# EAGLE design esp8266-blynk (EAGLE 7.5.0)
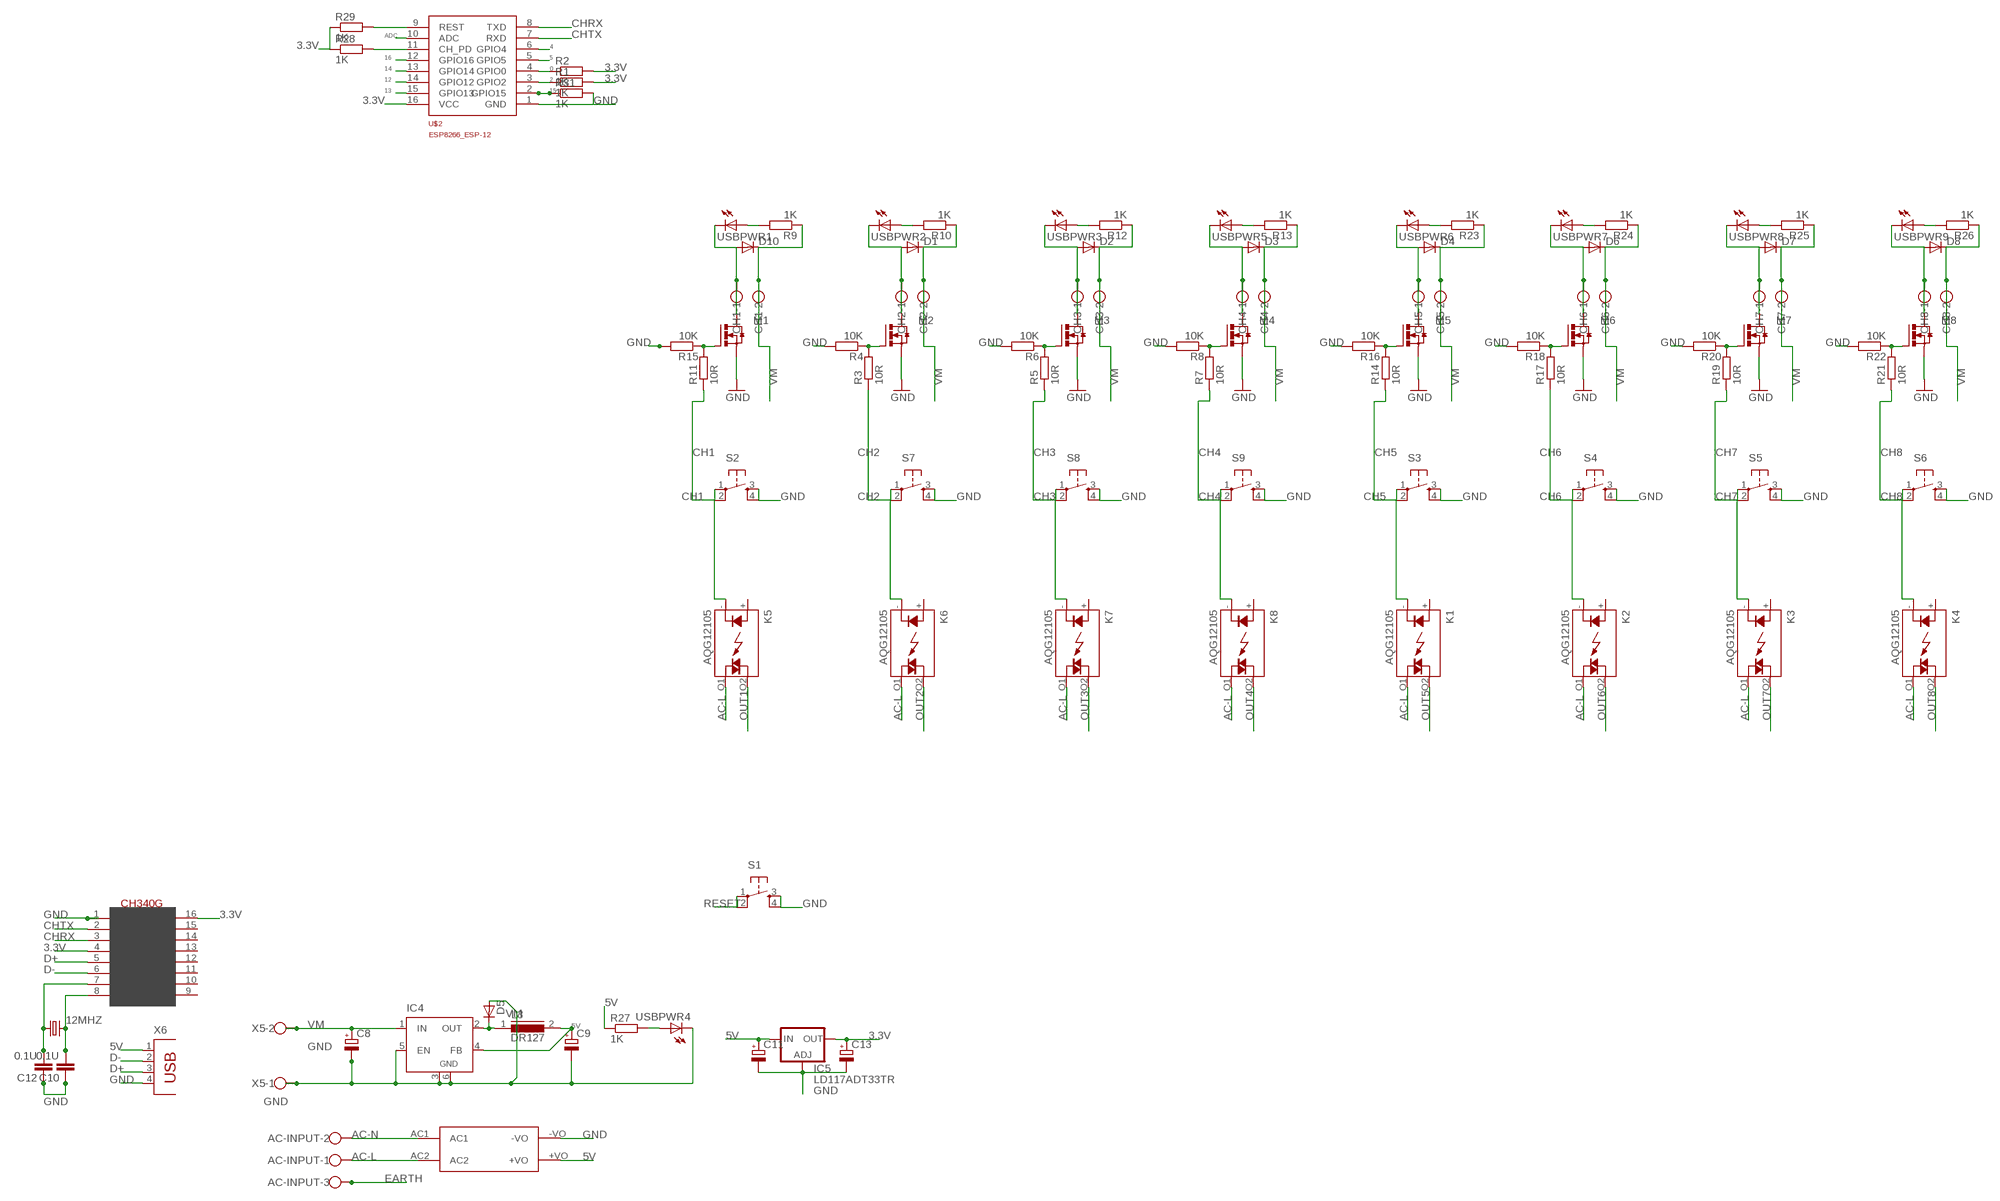
[diagram p0: schematic, sheet 1]

## Parts
12MHZ  CRYSTALHC49UP  [HC49UP]
AC-INPUT  W237-103  [W237-103]
C8  CPOL-EUE  [PANASONIC_E]
C9  CPOL-EUE  [PANASONIC_E]
C10  0.1U  C-EUC1206  [C1206]
C11  CPOL-EUC  [PANASONIC_C]
C12  0.1U  C-EUC1206  [C1206]
C13  CPOL-EUC  [PANASONIC_C]
CH1  W237-102  [W237-102]
CH2  W237-102  [W237-102]
CH3  W237-102  [W237-102]
CH4  W237-102  [W237-102]
CH5  W237-102  [W237-102]
CH6  W237-102  [W237-102]
CH7  W237-102  [W237-102]
CH8  W237-102  [W237-102]
D1  DIODESMA-ALT  [SMA-DIODE_ALT]
D2  DIODESMA-ALT  [SMA-DIODE_ALT]
D3  DIODESMA-ALT  [SMA-DIODE_ALT]
D4  DIODESMA-ALT  [SMA-DIODE_ALT]
D5  D-SOD-87  [SOD87]
D6  DIODESMA-ALT  [SMA-DIODE_ALT]
D7  DIODESMA-ALT  [SMA-DIODE_ALT]
D8  DIODESMA-ALT  [SMA-DIODE_ALT]
D10  DIODESMA-ALT  [SMA-DIODE_ALT]
IC4  LM2596S  [TO263-5]
IC5  LD117ADT33TR  [DPACK]
K1  AQG12105  [AQG]
K2  AQG12105  [AQG]
K3  AQG12105  [AQG]
K4  AQG12105  [AQG]
K5  AQG12105  [AQG]
K6  AQG12105  [AQG]
K7  AQG12105  [AQG]
K8  AQG12105  [AQG]
L3  DR127  [DR127]
M1  IRLR024N  [TO252]
M2  IRLR024N  [TO252]
M3  IRLR024N  [TO252]
M4  IRLR024N  [TO252]
M5  IRLR024N  [TO252]
M6  IRLR024N  [TO252]
M7  IRLR024N  [TO252]
M8  IRLR024N  [TO252]
R1  1K  R-EU_M1206  [M1206]
R2  1K  R-EU_M1206  [M1206]
R3  10R  R-EU_M1206  [M1206]
R4  10K  R-EU_M1206  [M1206]
R5  10R  R-EU_M1206  [M1206]
R6  10K  R-EU_M1206  [M1206]
R7  10R  R-EU_M1206  [M1206]
R8  10K  R-EU_M1206  [M1206]
R9  1K  R-EU_M1206  [M1206]
R10  1K  R-EU_M1206  [M1206]
R11  10R  R-EU_M1206  [M1206]
R12  1K  R-EU_M1206  [M1206]
R13  1K  R-EU_M1206  [M1206]
R14  10R  R-EU_M1206  [M1206]
R15  10K  R-EU_M1206  [M1206]
R16  10K  R-EU_M1206  [M1206]
R17  10R  R-EU_M1206  [M1206]
R18  10K  R-EU_M1206  [M1206]
R19  10R  R-EU_M1206  [M1206]
R20  10K  R-EU_M1206  [M1206]
R21  10R  R-EU_M1206  [M1206]
R22  10K  R-EU_M1206  [M1206]
R23  1K  R-EU_M1206  [M1206]
R24  1K  R-EU_M1206  [M1206]
R25  1K  R-EU_M1206  [M1206]
R26  1K  R-EU_M1206  [M1206]
R27  1K  R-EU_M1206  [M1206]
R28  1K  R-EU_M1206  [M1206]
R29  1K  R-EU_M1206  [M1206]
R31  1K  R-EU_M1206  [M1206]
S1  TAC_SWITCHPTH  [TACTILE-PTH]
S2  TAC_SWITCHPTH  [TACTILE-PTH]
S3  TAC_SWITCHPTH  [TACTILE-PTH]
S4  TAC_SWITCHPTH  [TACTILE-PTH]
S5  TAC_SWITCHPTH  [TACTILE-PTH]
S6  TAC_SWITCHPTH  [TACTILE-PTH]
S7  TAC_SWITCHPTH  [TACTILE-PTH]
S8  TAC_SWITCHPTH  [TACTILE-PTH]
S9  TAC_SWITCHPTH  [TACTILE-PTH]
U$1  HLK-PM01  [HLK-PM01]
U$2  ESP8266_ESP-12  [ESP8266-ESP12]
U$4  CH340G  [SOIC16]
USBPWR1  LED3MM  [LED3MM]
USBPWR2  LED3MM  [LED3MM]
USBPWR3  LED3MM  [LED3MM]
USBPWR4  LED3MM  [LED3MM]
USBPWR5  LED3MM  [LED3MM]
USBPWR6  LED3MM  [LED3MM]
USBPWR7  LED3MM  [LED3MM]
USBPWR8  LED3MM  [LED3MM]
USBPWR9  LED3MM  [LED3MM]
X5  W237-102  [W237-102]
X6  PN61729  [PN61729]

## Nets
0: R2.1 U$2.4(GPIO0)
2: R1.1 U$2.3(GPIO2)
3.3V: C13.+ IC5.4(OUT) R1.2 R2.2 R28.1 R29.1 U$2.16(VCC) U$4.4(V3) U$4.16(VCC)
4: U$2.6(GPIO4)
5: U$2.5(GPIO5)
5V: C9.+ C11.+ IC4.4(FB) IC5.3(IN) L3.2 R27.1 U$1.+VO X6.1
12: U$2.14(GPIO12)
13: U$2.15(GPIO13)
14: U$2.13(GPIO14)
15: R31.1 U$2.2(GPIO15)
16: U$2.12(GPIO16)
AC-L: AC-INPUT.1 K1.O1(DS2) K2.O1(DS2) K3.O1(DS2) K4.O1(DS2) K5.O1(DS2) K6.O1(DS2) K7.O1(DS2) K8.O1(DS2) U$1.AC2
AC-N: AC-INPUT.2 U$1.AC1
ADC: U$2.10(ADC)
CH1: K5.-(K) R11.1 S2.1 S2.2
CH2: K6.-(K) R3.1 S7.1 S7.2
CH3: K7.-(K) R5.1 S8.1 S8.2
CH4: K8.-(K) R7.1 S9.1 S9.2
CH5: K1.-(K) R14.1 S3.1 S3.2
CH6: K2.-(K) R17.1 S4.1 S4.2
CH7: K3.-(K) R19.1 S5.1 S5.2
CH8: K4.-(K) R21.1 S6.1 S6.2
CHRX: U$2.8(TXD) U$4.3(RX)
CHTX: U$2.7(RXD) U$4.2(TX)
D+: U$4.5(D+) X6.3
D-: U$4.6(D-) X6.2
EARTH: AC-INPUT.3
GND: C8.- C9.- C10.1 C11.- C12.1 C13.- D5.2(A) IC4.3(GND) IC4.5(EN) IC4.6(GND) IC5.1(ADJ) M1.2(S) M2.2(S) M3.2(S) M4.2(S) M5.2(S) M6.2(S) M7.2(S) M8.2(S) R4.2 R6.2 R8.2 R15.2 R16.2 R18.2 R20.2 R22.2 R31.2 S1.3 S1.4 S2.3 S2.4 S3.3 S3.4 S4.3 S4.4 S5.3 S5.4 S6.3 S6.4 S7.3 S7.4 S8.3 S8.4 S9.3 S9.4 U$1.-VO U$2.1(GND) U$4.1(GND) USBPWR4.K(C) X5.1 X6.4
N$1: M2.1(G) R3.2 R4.1
N$2: M3.1(G) R5.2 R6.1
N$3: M4.1(G) R7.2 R8.1
N$4: R9.2 USBPWR1.A
N$6: R10.2 USBPWR2.A
N$7: R12.2 USBPWR3.A
N$8: R13.2 USBPWR5.A
N$9: D5.1(C) IC4.2(OUT) L3.1
N$10: R27.2 USBPWR4.A
N$12: 12MHZ.1 C12.2 U$4.7(XI)
N$13: 12MHZ.2 C10.2 U$4.8(XO)
N$15: M5.1(G) R14.2 R16.1
N$18: R28.2 U$2.11(CH_PD)
N$20: M6.1(G) R17.2 R18.1
N$24: M7.1(G) R19.2 R20.1
N$28: M8.1(G) R21.2 R22.1
N$29: R23.2 USBPWR6.A
N$30: R24.2 USBPWR7.A
N$31: R25.2 USBPWR8.A
N$32: R26.2 USBPWR9.A
N$67: M1.1(G) R11.2 R15.1
OUT1: CH1.1 D10.A K5.O2(DS1) M1.3(D) USBPWR1.K(C)
OUT2: CH2.1 D1.A K6.O2(DS1) M2.3(D) USBPWR2.K(C)
OUT3: CH3.1 D2.A K7.O2(DS1) M3.3(D) USBPWR3.K(C)
OUT4: CH4.1 D3.A K8.O2(DS1) M4.3(D) USBPWR5.K(C)
OUT5: CH5.1 D4.A K1.O2(DS1) M5.3(D) USBPWR6.K(C)
OUT6: CH6.1 D6.A K2.O2(DS1) M6.3(D) USBPWR7.K(C)
OUT7: CH7.1 D7.A K3.O2(DS1) M7.3(D) USBPWR8.K(C)
OUT8: CH8.1 D8.A K4.O2(DS1) M8.3(D) USBPWR9.K(C)
RESET: R29.2 S1.1 S1.2 U$2.9(REST)
VM: C8.+ CH1.2 CH2.2 CH3.2 CH4.2 CH5.2 CH6.2 CH7.2 CH8.2 D1.C D2.C D3.C D4.C D6.C D7.C D8.C D10.C IC4.1(IN) R9.1 R10.1 R12.1 R13.1 R23.1 R24.1 R25.1 R26.1 X5.2
Unconnected: K1.+(A) K2.+(A) K3.+(A) K4.+(A) K5.+(A) K6.+(A) K7.+(A) K8.+(A) U$4.9(CTS) U$4.10(DSR) U$4.11(RI) U$4.12(DCD) U$4.13(DTR) U$4.14(RTS) U$4.15(RS232)

## Library data of the parts
12MHZ = crystal:CRYSTAL: CRYSTAL; OC_FARNELL: unknown; OC_NEWARK: unknown
AC-INPUT = con-wago-500:W237-103: WAGO SCREW CLAMP; MPN: 237-103; OC_FARNELL: unknown; OC_NEWARK: 18M7116
C8 C9 = resistor:CPOL-EU: POLARIZED CAPACITOR, European symbol
C10 C12 = rcl:C-EU: CAPACITOR, European symbol
C11 C13 = rcl:CPOL-EU: POLARIZED CAPACITOR, European symbol
CH1-CH8 X5 = con-wago-500:W237-102: WAGO SCREW CLAMP; MPN: 237-102; OC_FARNELL: unknown; OC_NEWARK: 70K9898
D1-D4 D6-D8 D10 = SparkFun-DiscreteSemi:DIODE: Diode These are standard reverse protection diodes and small signal diodes. SMA package can handle up to about 1A. SOD-323 can handle about 200mA. What the SOD-323 package when ordering, there are some mfgs out there that are 5-pin packages.
D5 = semicon-smd-ipc:D-: DIODE unfilled
IC4 = linear:LM2596S: STEP-DOWN VOLTAGE REGULATOR
IC5 = v-reg:LD117A?*: Low drop fixed and adjustable positive voltage regulators 1 A Source: http://www.st.com/stonline/products/literature/ds/7194/ld1117axx.pdf
K1-K8 = relay:AQG*: SOLID STATE RELAY NAiS Zero-cross, Non zero-cross Source: http://www.mew-europe.com/.. en_ds_61611_0000.pdf; MF: AROMAT/ MATSUSHITA; MPN: AQG12105; OC_FARNELL: unknown; OC_NEWARK: 20J4759
L3 = inductors:DR127: High Power Density, High Efficiency, Shielded Inductors Source: coiltronics_dr_series.pdf
M1-M8 = to252(1):IRLR024N
R1 R2 R9 R10 R12 R13 R23-R29 R31 = rcl:R-EU_: RESISTOR, European symbol
R3-R8 R11 R14-R22 = resistor:R-EU_: RESISTOR, European symbol
S1-S9 = SparkFun:TAC_SWITCH: Momentary Switch Button commonly used for reset or general input. Spark Fun Electronics SKU : COM-00097
U$1 = hlk-pm01:HLK-PM01
U$2 = ESP8266-ESP12:ESP8266_ESP-12: ESP8266 ESP-12 Discussion about pins here: http://www.esp8266.com/viewtopic.php?f=13&t=1429
U$4 = usb-serial:CH340G
USBPWR1-USBPWR9 = RepRapjr:LED: LED OSRAM: - CHIPLED LG R971, LG N971, LY N971, LG Q971, LY Q971, LO R971, LY R971 LH N974, LH R974 LS Q976, LO Q976, LY Q976 LO Q996 - Hyper CHIPLED LW Q18S LB Q993, LB Q99A, LB R99A - SideLED LS A670, LO A670, LY A670, LG A670, LP A670 LB A673, LV A673, LT A673, LW A673 LH A674 LY A675 LS A676, LA A676, LO A676, LY A676, LW A676 LS A679, LY A679, LG A679 - Hyper Micro SIDELED® LS Y876, LA Y876, LO Y876, LY Y876 LT Y87S - SmartLED LW L88C, LW L88S LB L89C, LB L89S, LG L890 LS L89K, LO L89K, LY L89K LS L896, LA L896, LO L896, LY L896 - TOPLED LS T670, LO T670, LY T670, LG T670, LP T670 LSG T670, LSP T670, LSY T670, LOP T670, LYG T670 LG T671, LOG T671, LSG T671 LB T673, LV T673, LT T673, LW T673 LH T674 LS T676, LA T676, LO T676, LY T676, LB T676, LH T676, LSB T676, LW T676 LB T67C, LV T67C, LT T67C, LS T67K, LO T67K, LY T67K, LW E67C LS E67B, LA E67B, LO E67B, LY E67B, LB E67C, LV E67C, LT E67C LW T67C LS T679, LY T679, LG T679 LS T770, LO T770, LY T770, LG T770, LP T770 LB T773, LV T773, LT T773, LW T773 LH T774 LS E675, LA E675, LY E675, LS T675 LS T776, LA T776, LO T776, LY T776, LB T776 LHGB T686 LT T68C, LB T68C - Hyper Mini TOPLED® LB M676 - Mini TOPLED Santana® LG M470 LS M47K, LO M47K, LY M47K Source: http://www.osram.convergy.de LUXEON: - LUMILED® LXK2-PW12-R00, LXK2-PW12-S00, LXK2-PW14-U00, LXK2-PW14-V00 LXK2-PM12-R00, LXK2-PM12-S00, LXK2-PM14-U00 LXK2-PE12-Q00, LXK2-PE12-R00, LXK2-PE12-S00, LXK2-PE14-T00, LXK2-PE14-U00 LXK2-PB12-K00, LXK2-PB12-L00, LXK2-PB12-M00, LXK2-PB14-N00, LXK2-PB14-P00, LXK2-PB14-Q00 LXK2-PR12-L00, LXK2-PR12-M00, LXK2-PR14-Q00, LXK2-PR14-R00 LXK2-PD12-Q00, LXK2-PD12-R00, LXK2-PD12-S00 LXK2-PH12-R00, LXK2-PH12-S00 LXK2-PL12-P00, LXK2-PL12-Q00, LXK2-PL12-R00 Source: www.luxeon.com KINGBRIGHT: KA-3528ASYC Source: www.kingbright.com
X6 = con-berg:PN61729: BERG USB connector; OC_FARNELL: unknown; OC_NEWARK: unknown

## Net classes
1 power: width 0.6 mm, clearance 0.305 mm

## Board
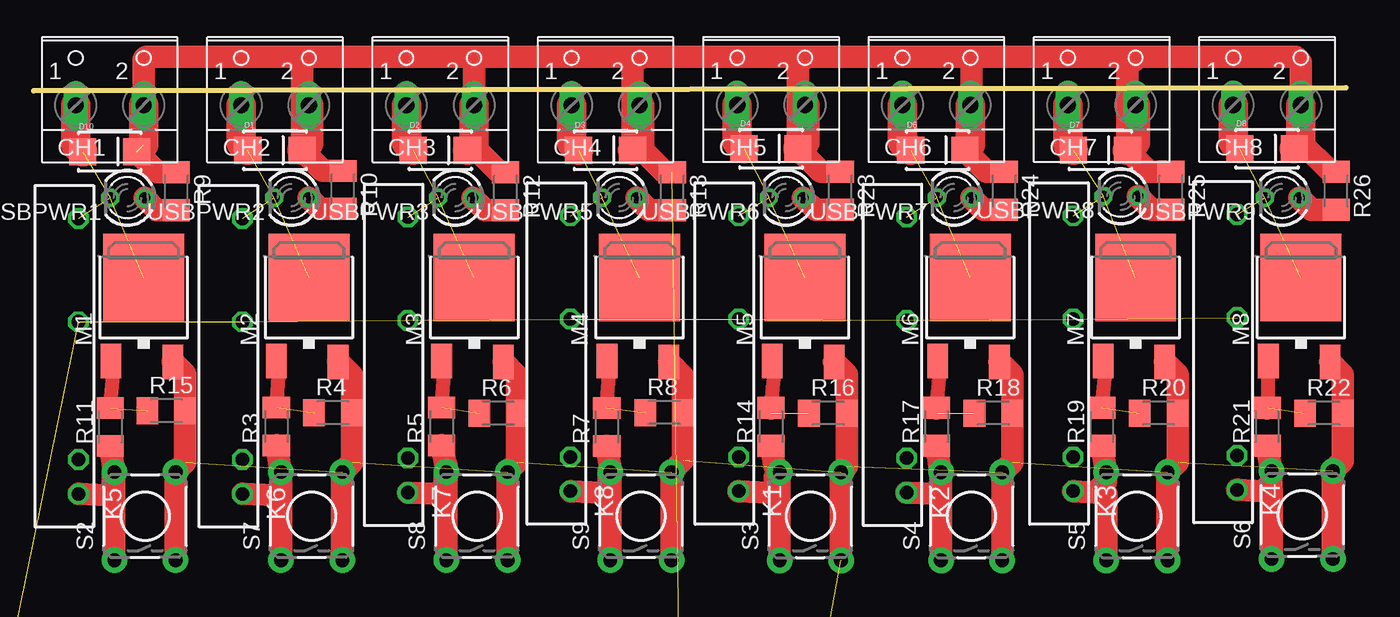
[diagram p1: board, top side]

Size 96.8 x 0.2 mm. Coordinates in mm from the lower left corner, seen from the top.
Outline: 0,0 96.8,0.2
Copper layers (1*16): Top 0.035mm / dielectric 1.5mm / Bottom 0.035mm
Design rules "dirt_cheap_dirty_boards.v1": minimum track width 5mil, minimum drill 12mil, track to track 5mil, track to pad 5mil, pad to pad 5mil, via to via 5mil, smd to smd 0mil, copper to edge 10mil, drill to drill 10mil, minimum pad ring 10mil, minimum via ring 6mil, stop-mask expansion 2mil, vias tented up to drill 25mil, thermal gap 10mil

### Footprints (pad centres in the part's own frame; a part is rotated, then mirrored left to right if it is on the bottom)
HC49UP = smd 5.334 x 1.93: 1 -4.826,0; 2 4.826,0
W237-103 = drill 1.194 long: 1 -5,-1.29; 2 0,-1.29; 3 5,-1.29
PANASONIC_E = smd 3.8 x 1.4: + 3,0; - -3,0
C1206 = smd 1.6 x 1.8: 1 -1.4,0; 2 1.4,0
PANASONIC_C = smd 2.6 x 1.4: + 2.05,0; - -2.05,0
W237-102 = drill 1.194 long: 1 -2.5,-1.27; 2 2.5,-1.27
SMA-DIODE_ALT = smd 2 x 2: A -2,0; C 2,0
SOD87 = smd 1.45 x 2.6: 1 -2.445,0; 2 2.445,0
TO263-5 = smd 1.067 x 2.159: 1 -3.404,-5.791; 2 -1.702,-5.791; 3 0,-5.791; 4 1.702,-5.791; 5 3.404,-5.791 | smd 10.8 x 10.41: 6 0,2.54
DPACK = smd 1.6 x 3: 1 -2.28,-4.8; 3 2.28,-4.8 | smd 5.8 x 6.2: 4 0,2.38
AQG = drill 1 octagon: + -7.62,0; - -10.16,0; O1 2.54,0; O2 10.16,0
DR127 = smd 3.85 x 5.5: 1 -4.975,0; 2 4.975,0
TO252 = smd 1.524 x 2.54: 1 -2.407,-3.657; 2 2.153,-3.72 | smd 5.97 x 6.48: 3 0,2.5
M1206 = smd 1.6 x 2: 1 -1.4,0; 2 1.4,0
TACTILE-PTH = drill 1.016 pad 1.88: 1 -3.251,2.261; 2 3.251,2.261; 3 -3.251,-2.261; 4 3.251,-2.261
HLK-PM01 = drill 1 long: +VO 31.7,2.4; -VO 31.7,17.8; AC1 2.3,12.6; AC2 2.3,7.6
ESP8266-ESP12 = smd 2 x 1.2: 1 16.2,2; 2 16.2,4; 3 16.2,6; 4 16.2,8; 5 16.2,10; 6 16.2,12; 7 16.2,14; 8 16.2,16; 9 0,16; 10 0,14; 11 0,12; 12 0,10; 13 0,8; 14 0,6; 15 0,4; 16 0,2
SOIC16 = smd 0.635 x 1.524: 1 -4.445,-2.695; 2 -3.175,-2.695; 3 -1.905,-2.695; 4 -0.635,-2.695; 5 0.635,-2.695; 6 1.905,-2.695; 7 3.175,-2.695; 8 4.445,-2.695; 9 4.445,2.695; 10 3.175,2.695; 11 1.905,2.695; 12 0.635,2.695; 13 -0.635,2.695; 14 -1.905,2.695; 15 -3.175,2.695; 16 -4.445,2.695
LED3MM = drill 0.813 octagon: A -1.27,0; K 1.27,0
PN61729 = drill 0.95 octagon: 1 1.25,4.71; 2 -1.25,4.71; 3 -1.25,2.71; 4 1.25,2.71 | hole 2.3: -6.02,0; 6.02,0

### Placement (x,y rotation side)
12MHZ  69.73,-59.39 0 top  (outside the outline)
AC-INPUT  -64.1,-378 0 top  (outside the outline)
C8  50.99,-64.89 180 top  (outside the outline)
C9  50.99,-48.7 180 top  (outside the outline)
C10  74.24,-54.58 180 top  (outside the outline)
C11  57.69,-42.93 90 top  (outside the outline)
C12  66.81,-54.62 180 top  (outside the outline)
C13  46.33,-44.93 90 top  (outside the outline)
CH1  5.59,0.19 0 top
CH2  17.79,0.19 0 top
CH3  29.99,0.19 0 top
CH4  42.19,0.19 0 top
CH5  54.4,0.2 0 top
CH6  66.6,0.2 0 top
CH7  78.8,0.2 0 top
CH8  91,0.2 0 top
D1  17.79,-4.41 0 top  (outside the outline)
D2  29.99,-4.41 0 top  (outside the outline)
D3  42.19,-4.41 0 top  (outside the outline)
D4  54.4,-4.3 0 top  (outside the outline)
D5  51.63,-57.27 0 top  (outside the outline)
D6  66.7,-4.4 0 top  (outside the outline)
D7  78.7,-4.4 0 top  (outside the outline)
D8  91,-4.3 0 top  (outside the outline)
D10  5.59,-4.51 0 top  (outside the outline)
IC4  36.39,-61.72 90 top  (outside the outline)
IC5  51.53,-44.22 90 top  (outside the outline)
K1  52,-19.4 90 top  (outside the outline)
K2  64.4,-19.5 90 top  (outside the outline)
K3  76.7,-19.4 90 top  (outside the outline)
K4  88.8,-19.3 90 top  (outside the outline)
K5  3.3,-19.6 90 top  (outside the outline)
K6  15.4,-19.6 90 top  (outside the outline)
K7  27.6,-19.5 90 top  (outside the outline)
K8  39.6,-19.4 90 top  (outside the outline)
L3  35.75,-47.74 180 top  (outside the outline)
M1  8.1,-16.3 0 top  (outside the outline)
M2  20.3,-16.3 0 top  (outside the outline)
M3  32.5,-16.3 0 top  (outside the outline)
M4  44.7,-16.3 0 top  (outside the outline)
M5  56.9,-16.3 0 top  (outside the outline)
M6  69.1,-16.3 0 top  (outside the outline)
M7  81.3,-16.3 0 top  (outside the outline)
M8  93.5,-16.3 0 top  (outside the outline)
R1  22.81,-66.3 0 top  (outside the outline)
R2  22.86,-69.47 0 top  (outside the outline)
R3  17.9,-24.78 90 top  (outside the outline)
R4  22.07,-23.77 0 top  (outside the outline)
R5  30.09,-24.78 90 top  (outside the outline)
R6  34.27,-23.81 0 top  (outside the outline)
R7  42.28,-24.82 90 top  (outside the outline)
R8  46.52,-23.76 0 top  (outside the outline)
R9  10.52,-7.43 270 top  (outside the outline)
R10  22.81,-7.33 270 top  (outside the outline)
R11  5.64,-24.83 90 top  (outside the outline)
R12  34.81,-7.43 270 top  (outside the outline)
R13  47.11,-7.43 270 top  (outside the outline)
R14  54.4,-24.8 90 top  (outside the outline)
R15  9.77,-23.62 0 top  (outside the outline)
R16  58.6,-23.8 0 top  (outside the outline)
R17  66.6,-24.8 90 top  (outside the outline)
R18  70.8,-23.8 0 top  (outside the outline)
R19  78.8,-24.8 90 top  (outside the outline)
R20  83,-23.8 0 top  (outside the outline)
R21  91,-24.8 90 top  (outside the outline)
R22  95.2,-23.8 0 top  (outside the outline)
R23  59.5,-7.4 270 top  (outside the outline)
R24  71.6,-7.4 270 top  (outside the outline)
R25  83.9,-7.4 270 top  (outside the outline)
R26  96.1,-7.4 270 top  (outside the outline)
R27  48.73,-72.63 270 top  (outside the outline)
R28  22.9,-76.23 180 top  (outside the outline)
R29  22.9,-72.76 180 top  (outside the outline)
R31  22.8,-62.96 180 top  (outside the outline)
S1  35.43,-72.81 180 top  (outside the outline)
S2  8.2,-31.4 90 top  (outside the outline)
S3  57.3,-31.41 90 top  (outside the outline)
S4  69.2,-31.41 90 top  (outside the outline)
S5  81.4,-31.41 90 top  (outside the outline)
S6  93.6,-31.31 90 top  (outside the outline)
S7  20.5,-31.4 90 top  (outside the outline)
S8  32.7,-31.4 90 top  (outside the outline)
S9  44.8,-31.4 90 top  (outside the outline)
U$1  -70.6,-373.1 0 top  (outside the outline)
U$2  20.04,-77.69 90 top  (outside the outline)
U$4  67.53,-68.41 90 top  (outside the outline)
USBPWR1  6.89,-7.92 180 top  (outside the outline)
USBPWR2  18.99,-7.91 180 top  (outside the outline)
USBPWR3  31.09,-7.91 180 top  (outside the outline)
USBPWR4  48.73,-78.21 270 top  (outside the outline)
USBPWR5  43.19,-7.91 180 top  (outside the outline)
USBPWR6  55.5,-7.9 180 top  (outside the outline)
USBPWR7  67.9,-7.9 180 top  (outside the outline)
USBPWR8  80.2,-7.8 180 top  (outside the outline)
USBPWR9  92.1,-7.9 180 top  (outside the outline)
X5  41.3,-74.42 0 top  (outside the outline)
X6  80.97,-69.07 90 top  (outside the outline)

### Tracks (layer width: path | path; a pad name or v marks a point on that pad's centre or on a via)
0  (1 unrouted)
2  (1 unrouted)
3.3V  (8 unrouted)
5V  (7 unrouted)
15  (1 unrouted)
AC-L  (9 unrouted)
AC-N  (1 unrouted)
CH1
  Top 1.676: R11.1 S2.2 | K5.- 5.34,-29.86 5.8,-29.4 5.8,-28.29 S2.2 | S2.1 S2.2
CH2
  Top 1.676: R3.1 18.2,-28.11 S7.2 | K6.- 17.84,-29.86 18.2,-29.5 18.2,-28.19 S7.2 | S7.1 S7.2
CH3
  Top 1.676: R5.1 30.39,-27.6 | 30.39,-27.6 30.39,-28.1 S8.2 30.3,-28.29 30.3,-29.2 29.74,-29.76 K7.- | S8.1 30.44,-27.65 30.39,-27.6
CH4
  Top 1.676: R7.1 42.58,-28.11 S9.2 | K8.- 41.94,-29.66 42.4,-29.2 42.4,-28.29 S9.2 | S9.1 S9.2
CH5
  Top 1.676: R14.1 54.7,-27.81 S3.2 | K1.- 54.24,-29.66 54.7,-29.2 54.7,-28.49 S3.2 | S3.1 S3.2
CH6
  Top 1.676: R17.1 66.9,-28.12 S4.2 | K2.- 66.44,-29.76 66.9,-29.3 66.9,-28.2 S4.2 | S4.1 S4.2
CH7
  Top 1.676: R19.1 79.1,-28.12 S5.2 79.1,-28.2 79.1,-28.9 78.7,-29.3 | K3.- 78.34,-29.66 78.7,-29.3 | S5.1 79.14,-29.74 78.7,-29.3
CH8
  Top 1.676: R21.1 91.3,-28.02 S6.2 91.3,-28.1 91.3,-29 91.1,-29.2 | K4.- 90.74,-29.56 91.1,-29.2 | S6.1 91.34,-29.44 91.1,-29.2
CHRX  (1 unrouted)
CHTX  (1 unrouted)
D+  (1 unrouted)
D-  (1 unrouted)
GND  (27 unrouted)
  Top 1.676: S2.3 S2.4 11.17,-27.44 R15.2 11.17,-20.94 M1.2 | S7.3 22.7,-34.59 22.7,-34.1 22.76,-34.04 S7.4 23.47,-27.44 R4.2 23.47,-21.04 M2.2 | S8.3 S8.4 35.67,-27.44 R6.2 35.67,-21.04 M3.2 | S9.3 S9.4 47.92,-27.29 R8.2 47.92,-21.09 M4.2 | S3.3 S3.4 60,-27.71 R16.2 60,-20.97 M5.2 | S4.3 S4.4 72.2,-27.42 R18.2 72.2,-20.97 M6.2 | S5.3 S5.4 84.4,-27.42 R20.2 84.4,-20.97 M7.2 | S6.3 S6.4 96.6,-27.32 R22.2 96.6,-20.97 M8.2
N$1  (1 unrouted)
  Top 1.016: R3.2 18.09,-20.48 M2.1
N$2  (1 unrouted)
  Top 1.016: R5.2 30.29,-20.48 M3.1
N$3  (1 unrouted)
  Top 1.016: R7.2 42.49,-20.52 M4.1
N$4
  Top 1.676: R9.2 9.07,-8.83 USBPWR1.A
N$6
  Top 1.676: R10.2 21.08,-8.73 USBPWR2.A
N$7
  Top 1.676: R12.2 33.28,-8.83 USBPWR3.A
N$8
  Top 1.676: R13.2 45.38,-8.83 USBPWR5.A
N$9  (2 unrouted)
N$10  (1 unrouted)
N$12  (2 unrouted)
N$13  (2 unrouted)
N$15  (1 unrouted)
  Top 1.016: M5.1 54.69,-20.5 R14.2 54.4,-23.8
N$18  (1 unrouted)
N$20  (1 unrouted)
  Top 1.016: M6.1 66.89,-20.5 R17.2 66.6,-23.8
N$24  (1 unrouted)
  Top 1.016: R19.2 79.09,-20.5 M7.1
N$28  (1 unrouted)
  Top 1.016: M8.1 91.09,-23.4 R21.2 91,-23.8
N$29
  Top 1.676: R23.2 57.67,-8.8 USBPWR6.A
N$30
  Top 1.676: R24.2 70.07,-8.8 USBPWR7.A
N$31
  Top 1.676: R25.2 82.47,-8.8 USBPWR8.A
N$32
  Top 1.676: R26.2 94.27,-8.8 USBPWR9.A
N$67  (1 unrouted)
  Top 1.016: R11.2 5.89,-20.53 M1.1
OUT1  (3 unrouted)
  Top 2.184: CH1.1 3.1,-4.01 D10.A
OUT2  (3 unrouted)
  Top 2.184: CH2.1 15.29,-3.91 D1.A
OUT3  (3 unrouted)
  Top 2.184: CH3.1 27.49,-3.91 D2.A
OUT4  (3 unrouted)
  Top 2.184: CH4.1 39.69,-3.91 D3.A
OUT5  (3 unrouted)
  Top 2.184: CH5.1 51.9,-3.8 D4.A
OUT6  (3 unrouted)
  Top 2.184: CH6.1 64.1,-3.8 D6.A
OUT7  (3 unrouted)
  Top 2.184: CH7.1 76.3,-4 D7.A
OUT8  (3 unrouted)
  Top 2.184: CH8.1 88.5,-3.8 D8.A
RESET  (3 unrouted)
VM  (4 unrouted)
  Top 0.61: 56.6,-4.5 D4.C | 68.8,-4.5 D6.C | 80.9,-4.6 D7.C | 44.3,-4.3 D3.C | 32.7,-4.4 32.35,-4.05 | D1.C | 8.49,-4.4 8.1,-4.01
  Top 1.676: 19.6,2.5 19.79,2.31 D1.C 21.31,-5.93 R10.1 | 19.6,2.5 8.3,2.5 8.1,2.3 CH1.2 | 19.6,2.5 32.7,2.5 | 32.7,2.5 44.8,2.5 | 44.8,2.5 57,2.5 | 57,2.5 69.2,2.5 | 69.2,2.5 81.5,2.5 | 81.5,2.5 93.1,2.5 93.5,2.1 CH8.2 | 81.5,2.5 80.7,1.7 D7.C 82.3,-6 R25.1 | 69.2,2.5 69.2,-3.4 69.1,-3.5 69.1,-4 D6.C 70.3,-6 R24.1 | 57,2.5 56.4,1.9 D4.C 58.1,-6 R23.1 | D3.C 44.19,1.89 44.8,2.5 | 32.5,-3.51 32.5,2.3 32.7,2.5 | 32.5,-4 32.5,-3.51 | 32.5,-3.51 32.49,-3.5 | R9.1 9.12,-6.03 D10.C | R12.1 34.33,-6.03 32.7,-4.4 | R13.1 46.53,-6.03 44.55,-4.05 | R26.1 95.7,-6 93.5,-3.8
  Top 2.184: CH2.2 20.29,-3.91 D1.C | CH1.2 8.1,-4.01 | CH3.2 32.49,-3.5 32.49,-3.91 32.35,-4.05 D2.C | CH4.2 44.69,-3.91 44.55,-4.05 D3.C | CH7.2 81.3,-3.8 D7.C | CH6.2 69.1,-4 | CH5.2 56.9,-3.8 D4.C | CH8.2 93.5,-3.8 D8.C